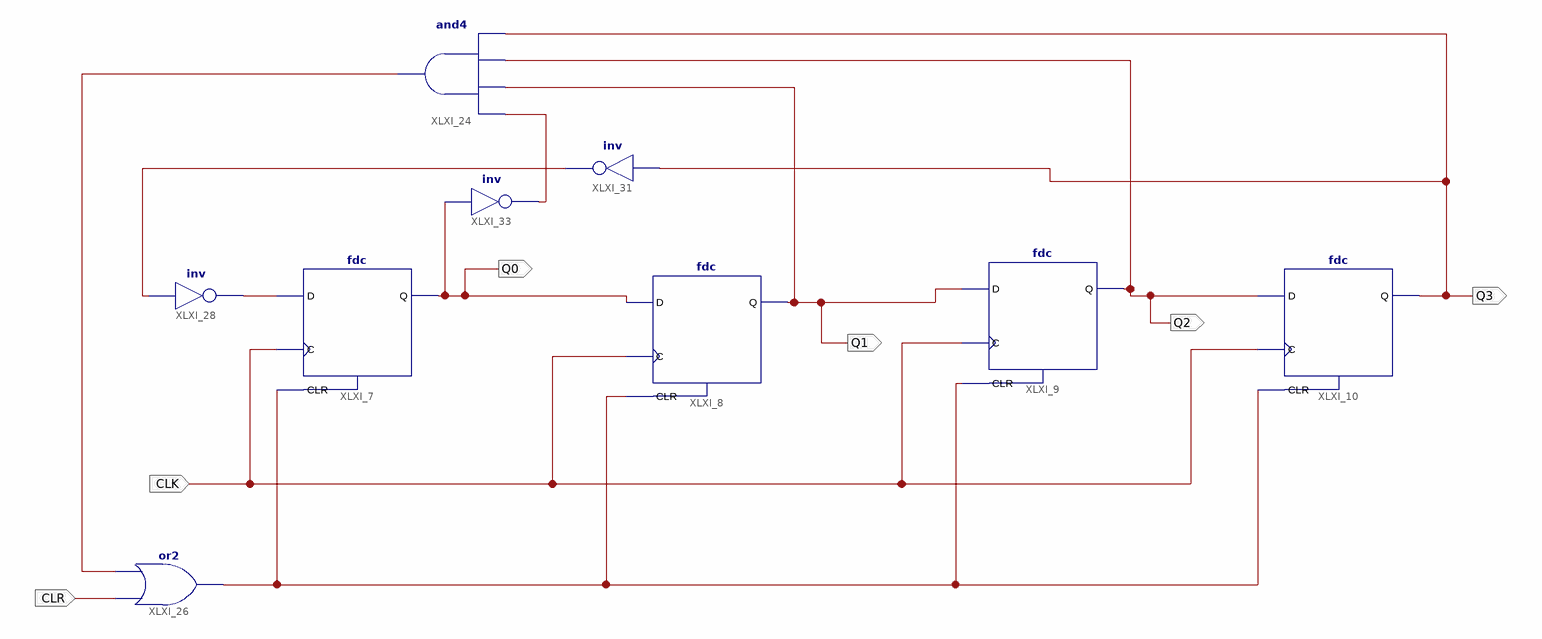
[diagram p0: schematic sheet 1]
// Xilinx ISE schematic p3ej1.sch (spartan3e) as structural Verilog: 9 symbols, 6 ports
module p3ej1 (
  input  CLK,
  input  CLR,
  output Q3,
  output Q2,
  output Q0,
  output Q1
);

  wire XLXN_125, XLXN_128;

  fdc XLXI_7 (.C(CLK), .CLR(CLR), .D(XLXN_125), .Q(Q0));
  fdc XLXI_9 (.C(CLK), .CLR(CLR), .D(Q1), .Q(Q2));
  fdc XLXI_10 (.C(CLK), .CLR(CLR), .D(Q2), .Q(Q3));
  fdc XLXI_8 (.C(CLK), .CLR(CLR), .D(Q0), .Q(Q1));
  and XLXI_24 (XLXN_128, Q3, Q2, Q1, Q0);
  or XLXI_26 (CLR, CLR, XLXN_128);
  not XLXI_28 (XLXN_125, Q3);
  not XLXI_31 (Q3, Q3);
  not XLXI_33 (Q0, Q0);
endmodule
